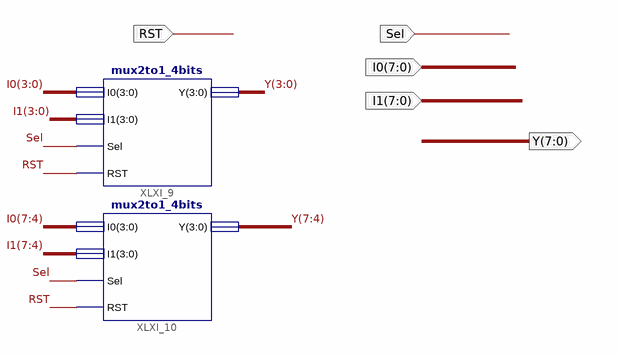
[diagram p0: schematic sheet 1]
// Xilinx ISE schematic mux2to1_8bits.sch (artix7) as structural Verilog: 2 symbols, 5 ports
module mux2to1_8bits (
  input  RST,
  input  Sel,
  input  [7:0] I0,
  input  [7:0] I1,
  output [7:0] Y
);

  mux2to1_4bits XLXI_9 (.I0(I0[3:0]), .I1(I1[3:0]), .RST(RST), .Sel(Sel), .Y(Y[3:0]));
  mux2to1_4bits XLXI_10 (.I0(I0[7:4]), .I1(I1[7:4]), .RST(RST), .Sel(Sel), .Y(Y[7:4]));
endmodule
